# EAGLE design servox6-2sch (EAGLE 7.2.0)
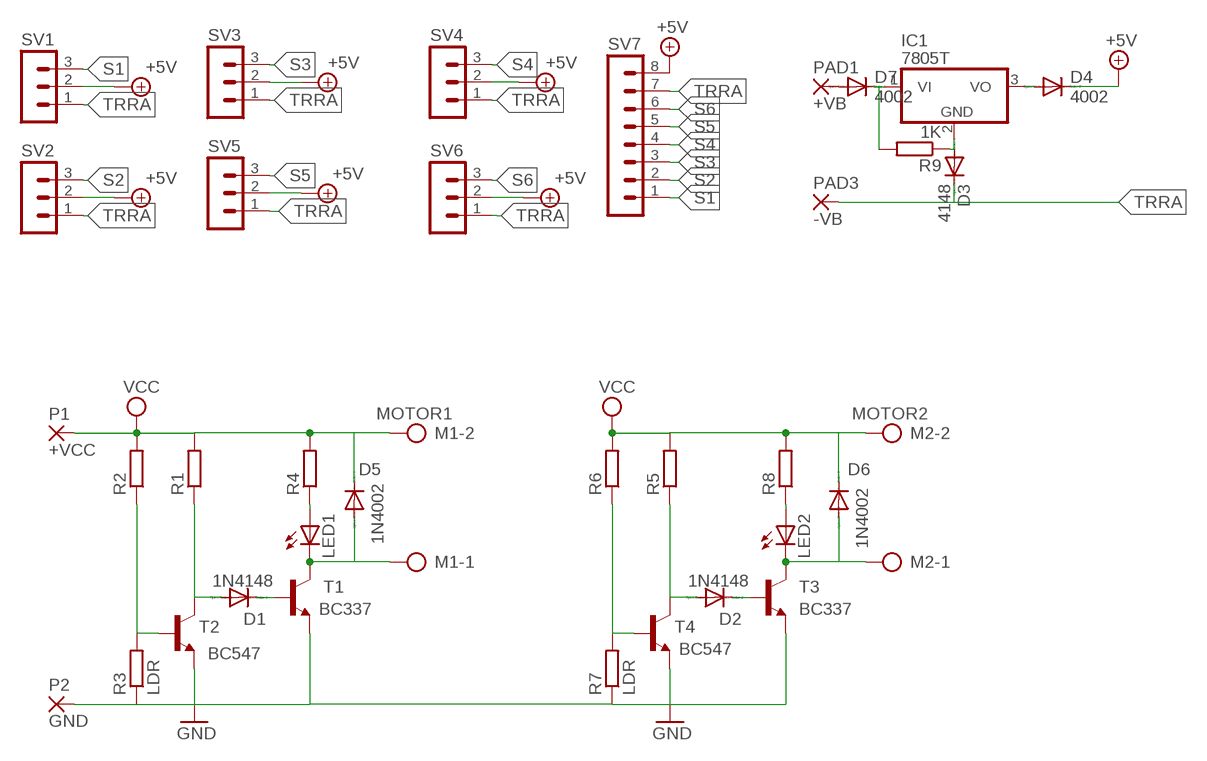
[diagram p0: schematic, sheet 1]

## Parts
D1  1N4148  1N4148DO35-7  [DO35-7]
D2  1N4148  1N4148DO35-7  [DO35-7]
D3  4148  1N4148DO35-7  [DO35-7]
D4  4002  1N4148DO35-7  [DO35-7]
D5  1N4002  1N4933  [DO41-10]
D6  1N4002  1N4933  [DO41-10]
D7  4002  1N4148DO35-7  [DO35-7]
IC1  7805T  [TO220H]
LED1  LED3MM  [LED3MM]
LED2  LED3MM  [LED3MM]
M1  MOTOR1  AK500/2  [AK500/2]
M2  MOTOR2  AK500/2  [AK500/2]
P1  +VCC  WIREPAD2,15/1,0  [2,15/1,0]
P2  GND  WIREPAD2,15/1,0  [2,15/1,0]
PAD1  +VB  WIREPAD1,6/0,9  [1,6/0,9]
PAD3  -VB  WIREPAD1,6/0,9  [1,6/0,9]
R1  R-EU_0207/7  [0207/7]
R2  R-EU_0207/7  [0207/7]
R3  LDR  R-EU_0204/5  [0204/5]
R4  R-EU_0207/7  [0207/7]
R5  R-EU_0207/7  [0207/7]
R6  R-EU_0207/7  [0207/7]
R7  LDR  R-EU_0204/5  [0204/5]
R8  R-EU_0207/7  [0207/7]
R9  1K  R-EU_0207/7  [0207/7]
SV1  MA03-1  [MA03-1]
SV2  MA03-1  [MA03-1]
SV3  MA03-1  [MA03-1]
SV4  MA03-1  [MA03-1]
SV5  MA03-1  [MA03-1]
SV6  MA03-1  [MA03-1]
SV7  MA08-1  [MA08-1]
T1  BC337  BC337-25-NPN-TO92-CBE  [TO92-CBE]
T2  BC547  BC547-NPN-TO92-CBE  [TO92-CBE]
T3  BC337  BC337-25-NPN-TO92-CBE  [TO92-CBE]
T4  BC547  BC547-NPN-TO92-CBE  [TO92-CBE]

## Nets
+5V: D4.C SV1.2 SV2.2 SV3.2 SV4.2 SV5.2 SV6.2 SV7.8
GND: P2.1(P) R3.1 R7.1 T1.E T2.E T3.E T4.E
N$1: D1.C T1.B
N$2: D1.A R1.1 T2.C
N$3: D5.A LED1.K(C) M1.1 T1.C
N$4: D3.A IC1.2(GND) R9.1
N$5: LED1.A R4.1
N$6: R2.1 R3.2 T2.B
N$7: D2.C T3.B
N$8: D2.A R5.1 T4.C
N$9: D6.A LED2.K(C) M2.1 T3.C
N$10: D4.A IC1.3(VO)
N$11: R6.1 R7.2 T4.B
N$12: LED2.A R8.1
N$13: D7.C IC1.1(VI) R9.2
N$18: D7.A PAD1.1(P)
S1: SV1.3 SV7.1
S2: SV2.3 SV7.2
S3: SV3.3 SV7.3
S4: SV4.3 SV7.4
S5: SV5.3 SV7.5
S6: SV6.3 SV7.6
TRRA: D3.C PAD3.1(P) SV1.1 SV2.1 SV3.1 SV4.1 SV5.1 SV6.1 SV7.7
VCC: D5.C D6.C M1.2 M2.2 P1.1(P) R1.2 R2.2 R4.2 R5.2 R6.2 R8.2

## Library data of the parts
D1-D4 D7 = diode:1N4148: DIODE high speed (Philips)
D5 D6 = diode:1N4933: DIODE fast recovery rectifier, 1A
IC1 = linear:78*: Positive VOLTAGE REGULATOR Source: http://cache.national.com/ds/LM/LM78L05.pdf http://www.fairchildsemi.com/ds/LM/LM7805.pdf
LED1 LED2 = led:LED: LED OSRAM: - CHIPLED LG R971, LG N971, LY N971, LG Q971, LY Q971, LO R971, LY R971 LH N974, LH R974 LS Q976, LO Q976, LY Q976 LO Q996 - Hyper CHIPLED LW Q18S LB Q993, LB Q99A, LB R99A - SideLED LS A670, LO A670, LY A670, LG A670, LP A670 LB A673, LV A673, LT A673, LW A673 LH A674 LY A675 LS A676, LA A676, LO A676, LY A676, LW A676 LS A679, LY A679, LG A679 - Hyper Micro SIDELED® LS Y876, LA Y876, LO Y876, LY Y876 LT Y87S - SmartLED LW L88C, LW L88S LB L89C, LB L89S, LG L890 LS L89K, LO L89K, LY L89K LS L896, LA L896, LO L896, LY L896 - TOPLED LS T670, LO T670, LY T670, LG T670, LP T670 LSG T670, LSP T670, LSY T670, LOP T670, LYG T670 LG T671, LOG T671, LSG T671 LB T673, LV T673, LT T673, LW T673 LH T674 LS T676, LA T676, LO T676, LY T676, LB T676, LH T676, LSB T676, LW T676 LB T67C, LV T67C, LT T67C, LS T67K, LO T67K, LY T67K, LW E67C LS E67B, LA E67B, LO E67B, LY E67B, LB E67C, LV E67C, LT E67C LW T67C LS T679, LY T679, LG T679 LS T770, LO T770, LY T770, LG T770, LP T770 LB T773, LV T773, LT T773, LW T773 LH T774 LS E675, LA E675, LY E675, LS T675 LS T776, LA T776, LO T776, LY T776, LB T776 LHGB T686 LT T68C, LB T68C - Hyper Mini TOPLED® LB M676 - Mini TOPLED Santana® LG M470 LS M47K, LO M47K, LY M47K Source: http://www.osram.convergy.de LUXEON: - LUMILED® LXK2-PW12-R00, LXK2-PW12-S00, LXK2-PW14-U00, LXK2-PW14-V00 LXK2-PM12-R00, LXK2-PM12-S00, LXK2-PM14-U00 LXK2-PE12-Q00, LXK2-PE12-R00, LXK2-PE12-S00, LXK2-PE14-T00, LXK2-PE14-U00 LXK2-PB12-K00, LXK2-PB12-L00, LXK2-PB12-M00, LXK2-PB14-N00, LXK2-PB14-P00, LXK2-PB14-Q00 LXK2-PR12-L00, LXK2-PR12-M00, LXK2-PR14-Q00, LXK2-PR14-R00 LXK2-PD12-Q00, LXK2-PD12-R00, LXK2-PD12-S00 LXK2-PH12-R00, LXK2-PH12-S00 LXK2-PL12-P00, LXK2-PL12-Q00, LXK2-PL12-R00 Source: www.luxeon.com KINGBRIGHT: KA-3528ASYC Source: www.kingbright.com
M1 M2 = con-ptr500:AK500/2: CONNECTOR; OC_FARNELL: unknown; OC_NEWARK: unknown
P1 P2 PAD1 PAD3 = wirepad:WIREPAD: Wire PAD connect wire on PCB
R1-R9 = resistor:R-EU_: RESISTOR, European symbol
SV1-SV6 = con-lstb:MA03-1: PIN HEADER; OC_FARNELL: unknown; OC_NEWARK: unknown
SV7 = con-lstb:MA08-1: PIN HEADER; OC_FARNELL: unknown; OC_NEWARK: unknown
T1-T4 = transistor:*-NPN-: NPN Transistror BF959 corrected 2008.03.06

## Board
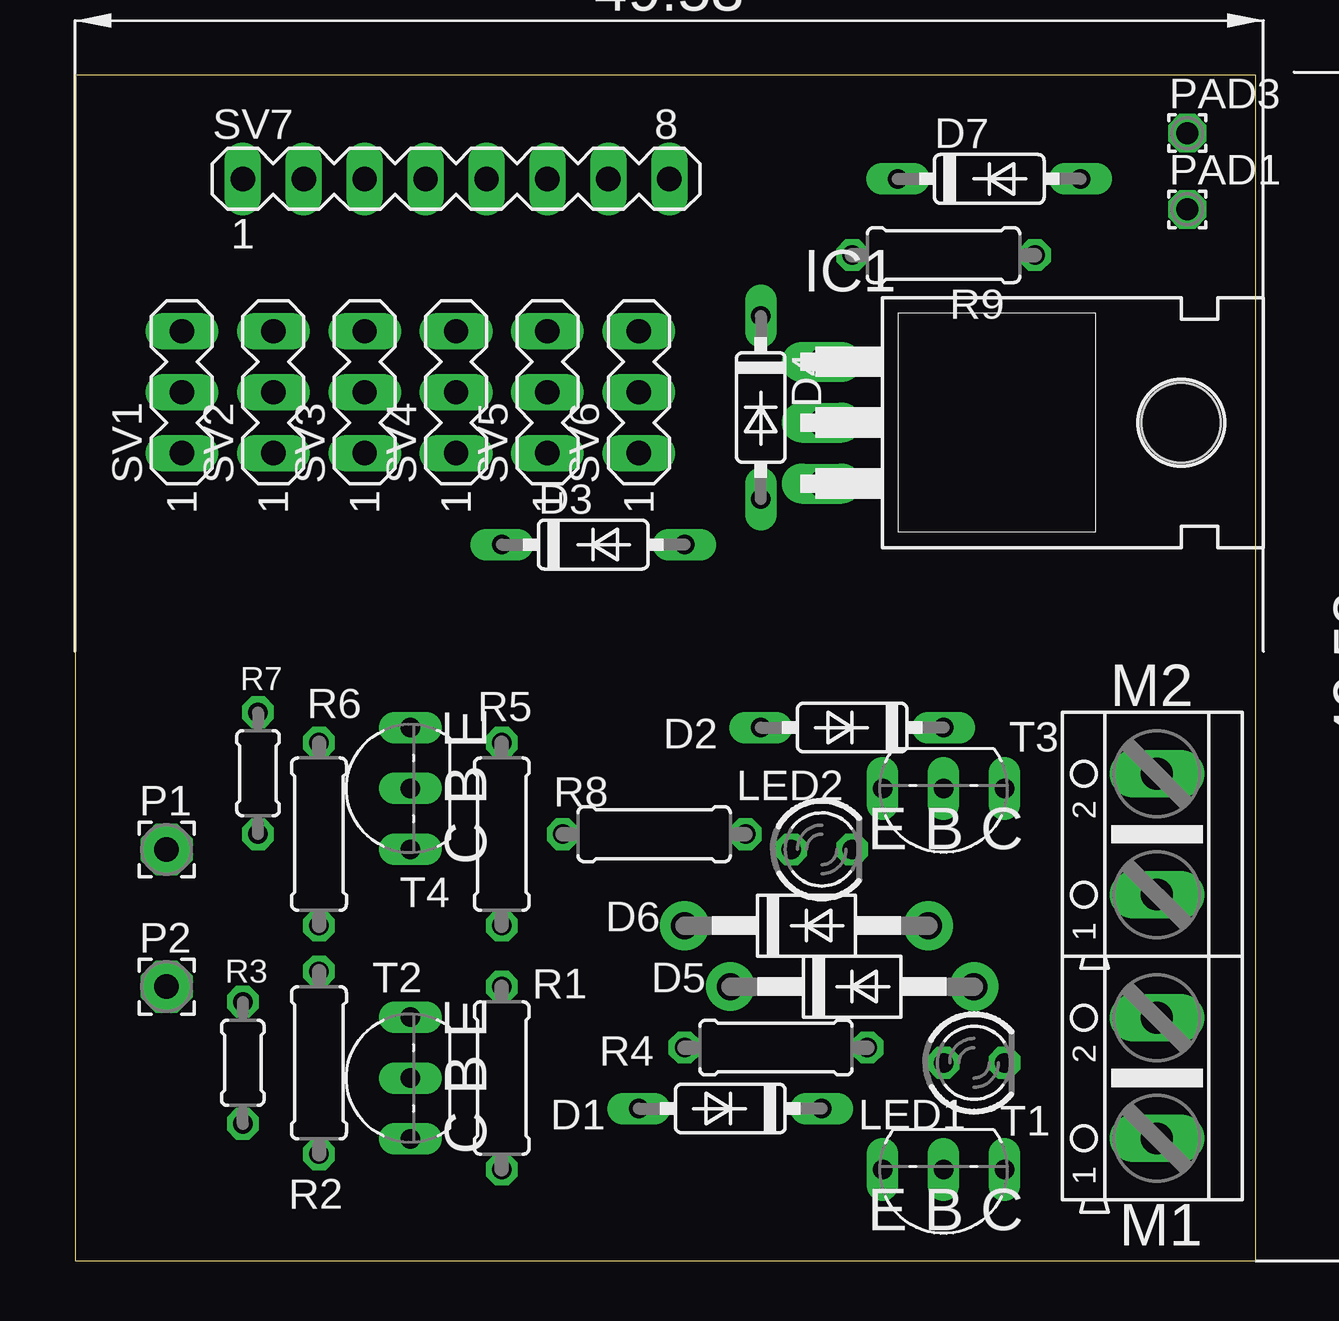
[diagram p1: board, top side]
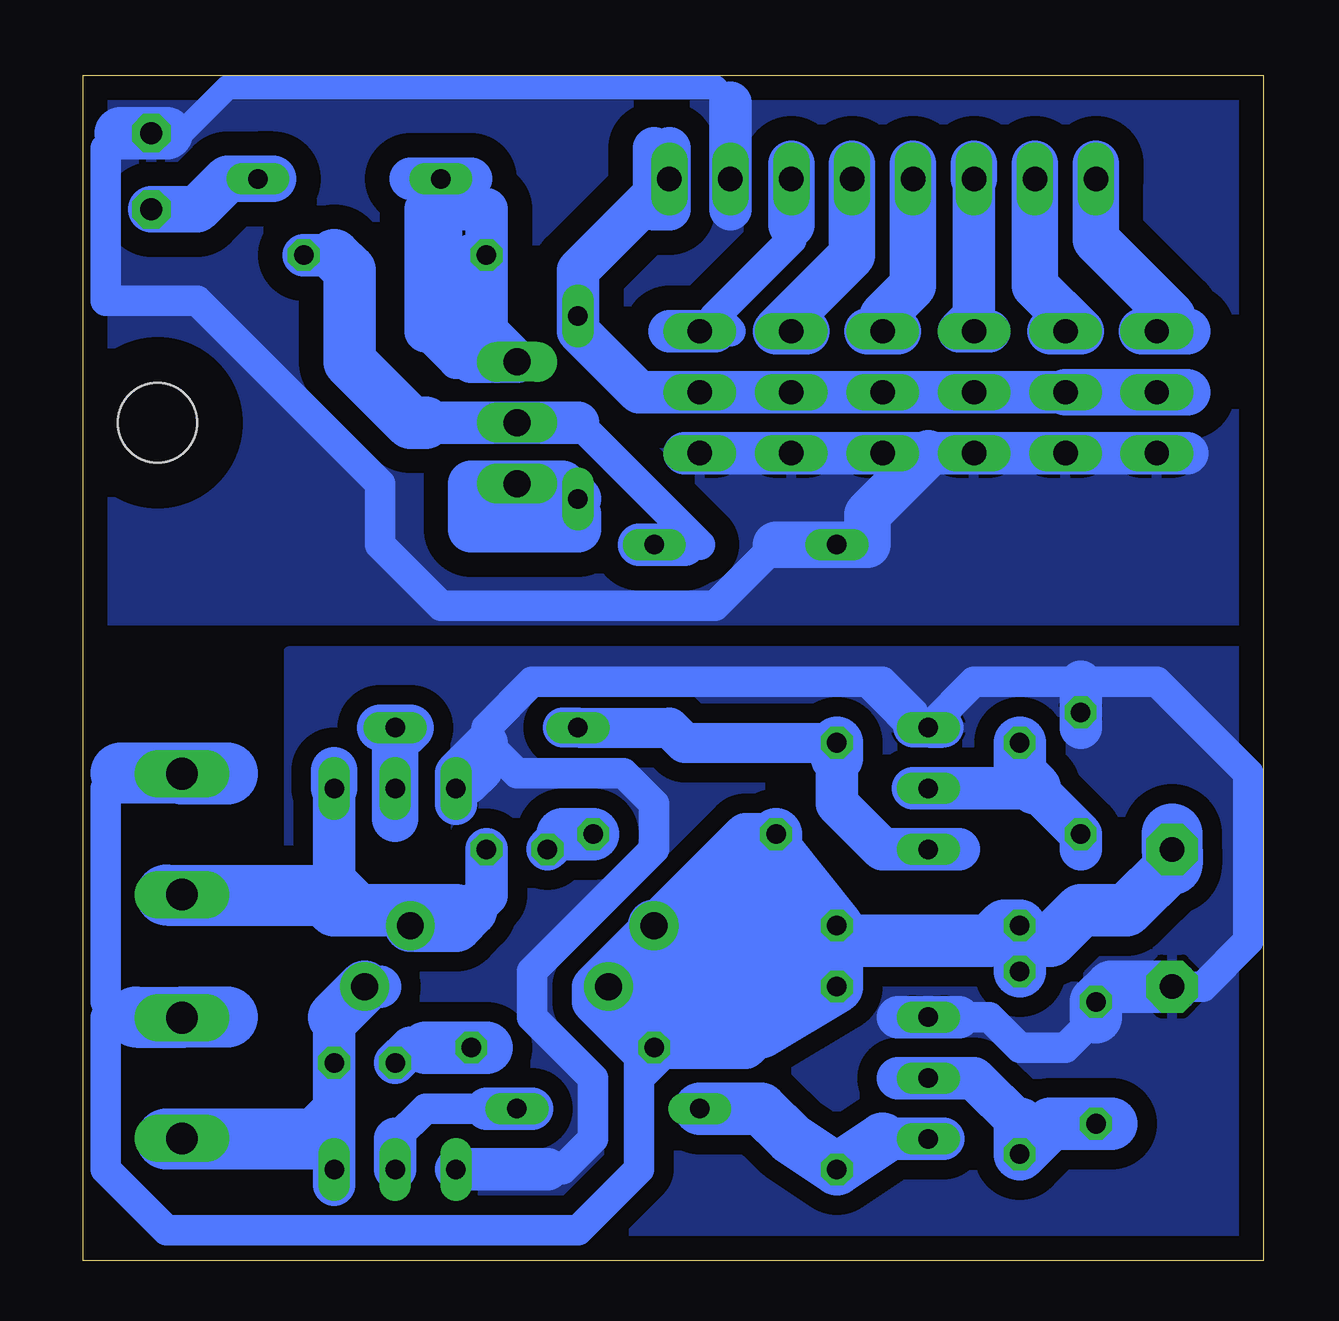
[diagram p2: board, bottom side, seen from below]

Size 49.2 x 49.39 mm. Coordinates in mm from the lower left corner, seen from the top.
Outline: 0,0 49.2,0 49.2,49.39 0,49.39 0,0
Copper layers (1*16): Top 0.035mm / dielectric 1.5mm / Bottom 0.035mm
Design rules "default": minimum track width 10mil, minimum drill 24mil, track to track 8mil, track to pad 8mil, pad to pad 8mil, via to via 8mil, smd to smd 8mil, copper to edge 40mil, drill to drill 8mil, minimum pad ring 10mil, minimum via ring 8mil, stop-mask expansion 4mil, vias tented up to drill 0mil, thermal gap 10mil

### Footprints (pad centres in the part's own frame; a part is rotated, then mirrored left to right if it is on the bottom)
DO35-7 = drill 0.813 long: A 3.81,0; C -3.81,0
DO41-10 = drill 1.118 pad 2.032: A 5.08,0; C -5.08,0
TO220H = drill 1.118 long: 1 -2.54,-10.16; 2 0,-10.16; 3 2.54,-10.16 | hole 3.302: 0,4.826
LED3MM = drill 0.813 octagon: A -1.27,0; K 1.27,0
AK500/2 = drill 1.321 long: 1 -2.515,0; 2 2.515,0
2,15/1,0 = drill 1.016 pad 2.159 octagon: 1 0,0
1,6/0,9 = drill 0.914 pad 1.6 octagon: 1 0,0
0207/7 = drill 0.813 octagon: 1 -3.81,0; 2 3.81,0
0204/5 = drill 0.813 octagon: 1 -2.54,0; 2 2.54,0
MA03-1 = drill 1.016 long: 1 -2.54,0; 2 0,0; 3 2.54,0
MA08-1 = drill 1.016 long: 1 -8.89,0; 2 -6.35,0; 3 -3.81,0; 4 -1.27,0; 5 1.27,0; 6 3.81,0; 7 6.35,0; 8 8.89,0
TO92-CBE = drill 0.813 long: B 0,0; C -2.54,0; E 2.54,0

### Placement (x,y rotation side)
D1  27.3,6.35 180 top
D2  32.39,22.23 180 top
D3  21.59,29.84 0 top
D4  28.57,35.56 270 top
D5  32.39,11.43 0 top
D6  30.48,13.97 0 top
D7  38.1,45.09 0 top
IC1  41.27,34.93 270 top
LED1  37.47,8.26 0 top
LED2  31.11,17.14 0 top
M1  45.09,7.62 90 top
M2  45.09,17.78 90 top
P1  3.81,17.14 0 top
P2  3.81,11.43 0 top
PAD1  46.36,43.81 0 top
PAD3  46.36,46.99 0 top
R1  17.78,7.62 90 top
R2  10.16,8.26 90 top
R3  6.99,8.26 270 top
R4  29.21,8.89 180 top
R5  17.78,17.78 270 top
R6  10.16,17.78 270 top
R7  7.62,20.32 270 top
R8  24.13,17.78 180 top
R9  36.2,41.91 180 top
SV1  4.45,36.2 90 top
SV2  8.26,36.2 90 top
SV3  12.06,36.2 90 top
SV4  15.88,36.2 90 top
SV5  19.68,36.2 90 top
SV6  23.49,36.2 90 top
SV7  15.88,45.09 0 top
T1  36.2,3.81 180 top
T2  13.97,7.62 90 top
T3  36.2,19.69 180 top
T4  13.97,19.69 90 top

### Tracks (layer width: path | path; a pad name or v marks a point on that pad's centre or on a via)
+5V
  Bottom 1.778: D4.C 28.57,40.01 | D4.C 28.57,38.73 26.04,36.2 SV6.2 SV5.2 SV4.2 SV3.2 SV2.2 | 24.76,46.36 SV7.8 24.76,43.81 25.4,43.81 25.4,44.45 | 25.4,46.36 25.4,44.45 | 25.4,44.45 28.57,41.27 D4.C
  Bottom 1.93: 3.17,36.2 SV1.2 SV2.2
GND
  Bottom 1.27: 29.84,3.81 29.21,3.81 27.94,5.08 27.94,7.62 30.48,10.16 30.48,12.06 25.4,17.14 25.4,19.05 26.67,20.32 31.11,20.32 32.39,21.59 32.39,22.23 30.48,24.13 16.51,24.13 | 32.39,20.32 33.02,19.69 T3.E | 14.61,22.23 15.24,22.86 | 16.51,24.13 15.88,24.13 14.61,22.86 15.24,22.86 | 15.24,22.86 16.51,24.13 | T4.E 12.06,24.13 7.62,24.13 4.45,24.13 0.64,20.32 0.64,13.33 2.54,11.43 6.35,11.43 | 12.7,10.16 11.43,10.16 10.16,8.89 8.26,8.89 6.99,10.16
  Bottom 1.676: 13.34,22.23 T4.E 14.61,22.23
  Bottom 1.778: T1.E 29.84,3.81 | 33.66,19.05 T3.E 33.66,20.32 32.39,21.59 | 7.62,24.13 R7.1 7.62,22.23 | 15.24,10.16 T2.E 12.7,10.16
  Bottom 2.184: 6.99,10.16 R3.1 6.35,11.43 P2.1
  pour Bottom (isolate 0.813): 0,25.4 40.64,25.4 40.64,0 0,0
N$1
  Bottom 1.27: 36.2,5.08 34.93,6.35 32.39,6.35
  Bottom 1.778: T1.B 36.2,5.08 | 32.39,6.35 D1.C 30.48,6.35
N$2
  Bottom 1.778: 13.34,5.08 T2.C 15.88,5.08
  Bottom 2.184: 15.88,5.08 R1.1 19.68,5.08 20.95,6.35 D1.A
N$3
  Bottom 1.778: 38.73,4.44 T1.C | D5.A 36.83,11.43 | 38.73,6.35 LED1.K 38.73,10.16 | 38.73,6.35 T1.C | 38.73,3.17 T1.C | 39.37,5.08 39.37,5.71 38.73,6.35
  Bottom 2.184: D5.A 38.73,10.16 | M1.1 45.7,5.1 45.72,5.08
  Bottom 2.54: 45.72,5.08 39.37,5.08
N$4
  Bottom 1.27: 28.57,34.93 23.49,29.84 24.13,29.84
  Bottom 1.778: 38.73,41.91 R9.1 | D3.A 24.76,29.84 | 28.57,34.93 IC1.2 34.93,34.93 | 24.13,29.84 D3.A | 26.04,29.84 D3.A
  Bottom 2.184: 34.93,34.93 35.56,34.93 38.1,37.47 38.1,41.27 38.73,41.91
N$5
  Bottom 1.778: LED1.A 35.56,8.89 34.93,8.89
  Bottom 2.184: 34.93,8.89 R4.1 32.39,8.89
N$6
  Bottom 1.778: 15.24,7.62 T2.B 12.06,7.62 10.16,5.71
  Bottom 2.184: 10.16,5.71 R2.1 8.89,5.71 R3.2 6.35,5.71
N$7
  Bottom 1.93: 36.2,18.41 T3.B 36.2,21.59 35.56,22.23 D2.C 36.83,22.23
N$8
  Bottom 1.676: R5.1 24.13,21.59 24.76,22.23 D2.A 29.21,22.23
  Bottom 1.778: 12.7,17.14 T4.C 15.88,17.14 17.78,19.05 17.78,20.95
  Bottom 2.184: 17.78,20.95 R5.1
N$9
  Bottom 1.422: 39.37,15.24 38.73,15.24
  Bottom 1.778: 38.73,20.32 T3.C 38.73,15.87 37.47,14.6 | LED2.K 32.39,15.24 33.02,14.6
  Bottom 1.93: T3.C 38.73,20.45
  Bottom 2.184: 33.02,14.6 33.66,13.97 D6.A 34.29,13.97 33.66,14.6 37.47,14.6 38.1,14.6 | 38.1,14.6 38.73,15.24 | M2.1 39.4,15.26 39.37,15.24 38.73,14.6 38.1,14.6
  Bottom 2.54: 45.72,15.24 39.37,15.24
N$10
  Bottom 1.93: D4.A 29.21,32.38 IC1.3 | IC1.3 33.02,32.38 33.02,30.48 28.57,30.48 28.57,31.12 29.84,31.12 IC1.3
N$11
  Bottom 1.778: 7.62,17.14 R7.2 9.53,19.69 T4.B 14.61,19.69
  Bottom 2.184: 9.53,19.69 10.16,20.32 R6.1
N$12
  Bottom 1.778: LED2.A 29.21,17.78
  Bottom 2.184: 29.21,17.78 R8.1
N$13
  Bottom 1.422: 33.02,37.47 33.66,37.47 34.93,38.73 | 34.93,44.45 35.56,45.09
  Bottom 1.778: 33.02,37.47 IC1.1 32.39,38.73 R9.2 | 35.56,45.09 D7.C | 33.02,45.09 D7.C | 34.93,38.73 34.93,43.81 32.39,43.81 R9.2 | R9.2 33.02,41.91 33.02,38.73 34.29,38.73 D7.C
N$18
  Bottom 1.93: PAD1.1 44.45,43.81 43.18,45.09 D7.A 41.27,45.09
S1
  Bottom 1.93: SV1.3 3.17,38.73 | 5.08,38.73 SV1.3 | SV1.3 3.81,39.37 6.99,42.55 SV7.1 6.99,45.72
S2
  Bottom 1.93: 8.89,38.73 SV2.3 7.62,38.73 9.53,40.64 SV7.2 9.53,45.72
S3
  Bottom 1.778: 11.43,38.73 SV3.3 12.7,38.73 12.06,39.37 SV7.3
  Bottom 1.93: 12.06,45.72 SV7.3
S4
  Bottom 1.93: SV4.3 16.51,38.73 | 15.24,38.73 SV4.3 | SV4.3 15.88,39.37 14.61,40.64 SV7.4 14.61,45.72
S5
  Bottom 1.93: 19.05,38.73 SV5.3 20.32,38.73 17.14,41.91 SV7.5 17.14,45.72
S6
  Bottom 1.27: 19.68,43.18 19.68,42.55 22.86,39.37 22.22,38.73 22.86,38.73
  Bottom 1.778: 22.86,38.73 SV6.3 24.76,38.73
  Bottom 1.93: 19.68,45.72 SV7.6 19.68,43.18
TRRA
  Bottom 1.016: 22.22,48.26 22.86,48.9 43.18,48.9 45.09,46.99 45.72,46.99
  Bottom 1.27: 47.62,46.99 48.26,46.36 48.26,40.01 44.45,40.01 36.83,32.38 36.83,29.84 34.29,27.3 22.86,27.3 20.32,29.84
  Bottom 1.778: 3.17,33.66 SV1.1 SV2.1 SV3.1 13.97,33.66 SV4.1 SV5.1 SV6.1 24.13,33.66 | 22.22,43.81 SV7.7 22.22,48.26
  Bottom 1.93: 20.32,29.84 16.51,29.84 16.51,31.12 13.97,33.66
  Bottom 2.184: 45.72,46.99 PAD3.1 47.62,46.99
  pour Bottom (isolate 1.016): 0,26.67 48.9,26.67 48.9,49.53 0,49.53
VCC
  Bottom 1.27: 47.62,20.32 48.26,19.69 48.26,10.79 47.62,10.16 46.99,10.16 | M1.2 48.23,10.13 48.26,10.16 48.26,3.81 45.72,1.27 28.57,1.27 26.04,3.81 26.04,7.62 | 26.04,7.62 24.76,8.89 24.76,9.53 R4.2 26.04,8.26 26.04,7.62
  Bottom 1.778: 20.95,9.53 21.59,8.89 R4.2 26.04,8.89 27.94,10.79 27.94,11.43 D6.C 21.59,17.78 R8.2
  Bottom 2.184: R2.2 10.16,13.33 | 10.16,13.33 R6.2 10.79,13.97 11.43,13.33 17.78,13.33 R5.2 | R5.2 20.32,17.14 R8.2 | R5.2 R1.2 20.95,9.53 | D6.C 22.86,13.97 20.95,15.87 20.95,15.24 19.68,13.97 19.68,12.7 22.22,10.16 25.4,10.16 26.67,11.43 25.4,11.43 24.13,12.7 22.22,12.7 21.59,13.33 21.59,12.7 22.86,11.43 D5.C | 3.81,16.51 5.71,14.6 7.62,14.6 8.89,13.33 10.16,13.33
  Bottom 2.54: M2.2 43.18,20.3 43.18,20.32 47.62,20.32 | 46.99,10.16 45.06,10.16 | 43.18,10.16 45.06,10.16 | 45.06,10.16 M1.2 | 3.81,17.78 P1.1 3.81,16.51

### Text on the board
tPlace: C | E B C | C B E | C B E | E B C